# EasyEDA Pro project CH335fUSBHub_250914_A.epro

# Schematic CH335HUB_SCH
Board Name: CH335HUB; Create Date: 2025-09-14; Page Name: P1; Project Name: CH335F USB HUB; Schematic Name: CH335HUB_SCH; Update Date: 2025-09-14; Company: 嘉立创EDA; Page Size: A4; Version: V1.0
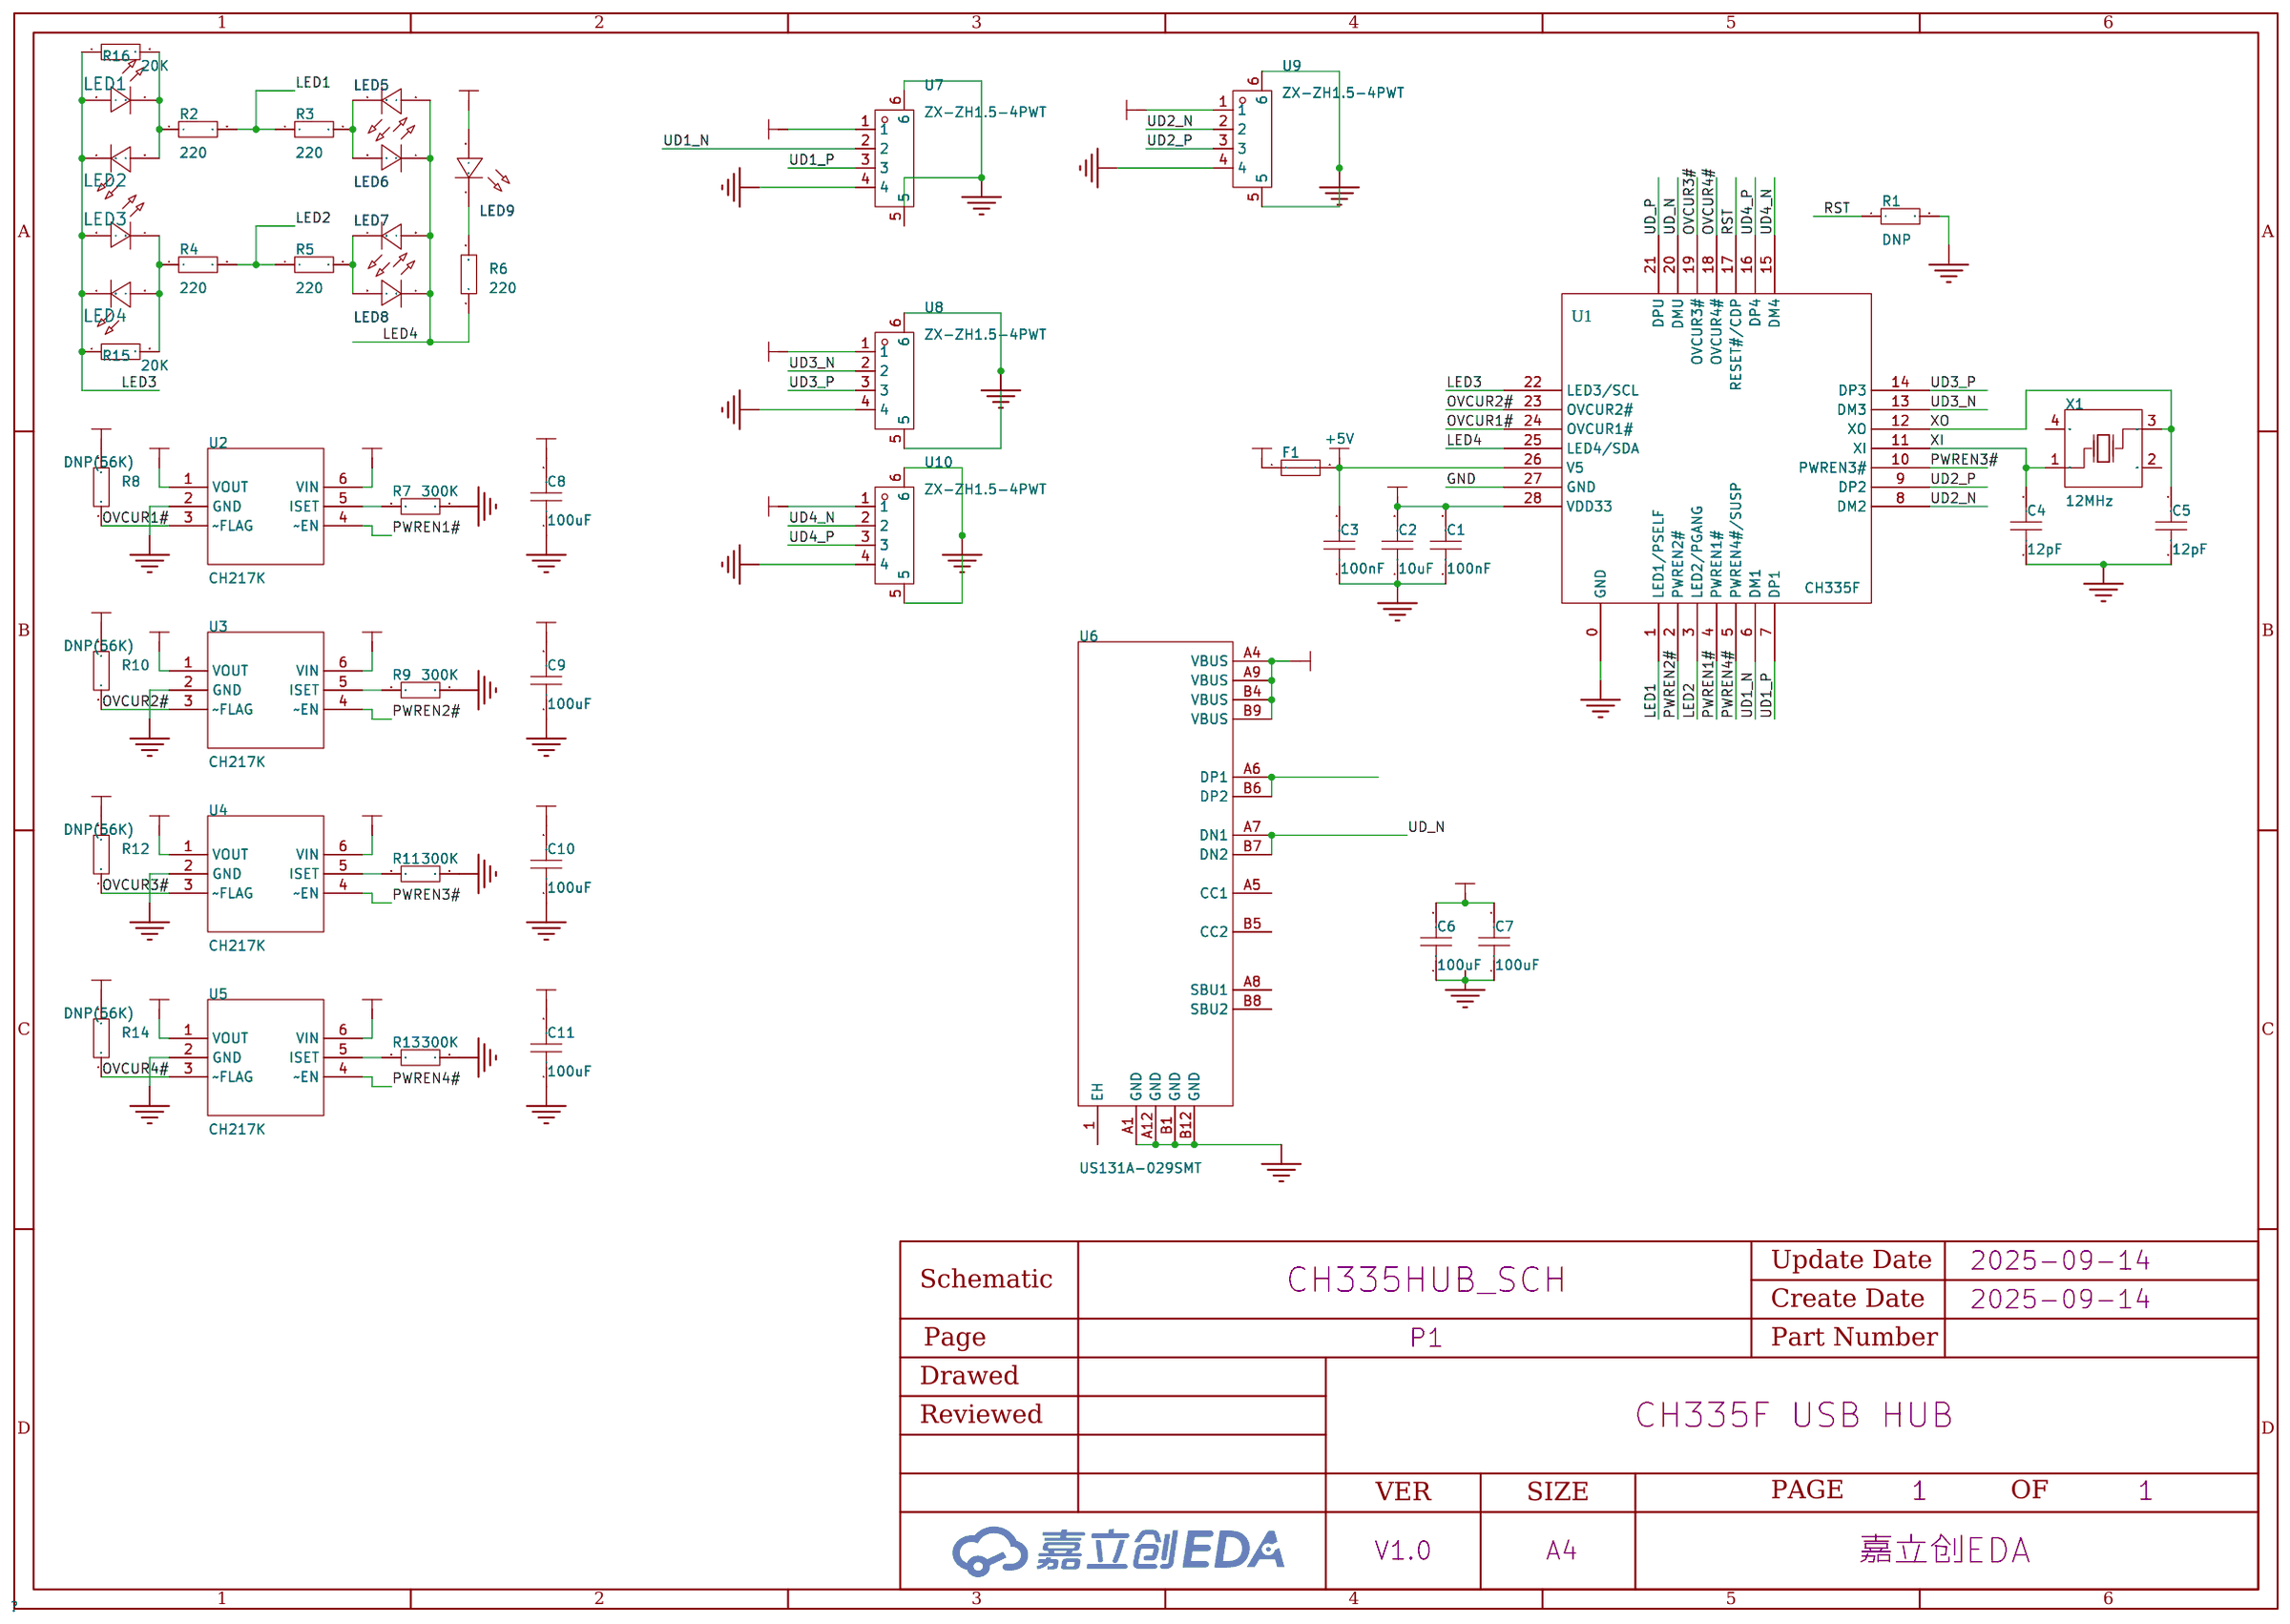
[diagram p0: schematic sheet]

## Parts
C1  100nF  [C0805]
C2  10uF  [C0805]
C3  100nF  [C0805]
C4  12pF  [C0805]
C5  12pF  [C0805]
C6  100uF  [C1206]
C7  100uF  [C1206]
C8  100uF  [C1206]
C9  100uF  [C1206]
C10  100uF  [C1206]
C11  100uF  [C1206]
F1  SMD0805B050TF  [F0805]
LED1  -  [LED_0805]
LED2  -  [LED_0805]
LED3  -  [LED_0805]
LED4  -  [LED_0805]
LED5  -  [LED_0805]
LED6  -  [LED_0805]
LED7  -  [LED_0805]
LED8  -  [LED_0805]
LED9  -  [LED_0805]
R1  DNP  [R0805]
R2  220  [R0805]
R3  220  [R0805]
R4  220  [R0805]
R5  220  [R0805]
R6  220  [R0805]
R7  300K  [R0805]
R8  DNP(56K)  [R0805]
R9  300K  [R0805]
R10  DNP(56K)  [R0805]
R11  300K  [R0805]
R12  DNP(56K)  [R0805]
R13  300K  [R0805]
R14  DNP(56K)  [R0805]
R15  20K  [R0805]
R16  20K  [R0805]
U1  CH335F  [QFN-28_L4.0-W4.0-P0.40-TL]
U2  CH217K  [SOT-23-6_L2.9-W1.6-P0.95-LS2.8-TL]
U3  CH217K  [SOT-23-6_L2.9-W1.6-P0.95-LS2.8-TL]
U4  CH217K  [SOT-23-6_L2.9-W1.6-P0.95-LS2.8-TL]
U5  CH217K  [SOT-23-6_L2.9-W1.6-P0.95-LS2.8-TL]
U6  US131A-029SMT  [USB-TYPE-C-SMD_US131A-029SMT]
U7  ZX-ZH1.5-4PWT  [CONN-SMD_4P-P1.50_ZX-ZH1.5-4PWT]
U8  ZX-ZH1.5-4PWT  [CONN-SMD_4P-P1.50_ZX-ZH1.5-4PWT]
U9  ZX-ZH1.5-4PWT  [CONN-SMD_4P-P1.50_ZX-ZH1.5-4PWT]
U10  ZX-ZH1.5-4PWT  [CONN-SMD_4P-P1.50_ZX-ZH1.5-4PWT]
X1  12MHz  [OSC-SMD_4P-L3.2-W2.5-BL]

## Library data of the parts
C1-C5 = CAP_0805: Supplier Footprint: 0805
C6-C11 = CAP_1206: Supplier Footprint: 1206
F1 = SMD0805B050TF: 最大电压:6V;最大电流:100A;保持电流:500mA;跳闸电流:1A;; LCSC Part Name: 6V 500mA 0805自恢复; Supplier Part: C269104; Manufacturer: Brightking(君耀电子); Supplier Footprint: 0805; JLCPCB Part Class: Extended Part; Datasheet: https://atta.szlcsc.com/upload/public/pdf/source/20180814/C269104_466839A5DB65F6E723CA6A162ACE747B.pdf; Supplier: LCSC; Operating Voltage (Max): 6V; Current Rating (Max): 100A; Hold Current: 500mA; Trip Current: 1A; Maximum Time to Trip: 100ms
LED1-LED4 = LED_0805-R: Supplier Footprint: 0805
LED5-LED9 = LED_0805-G: Supplier Footprint: 0805
R1-R16 = Res_0805: Supplier Footprint: 0805
U1 = CH335F-LBX: 4 ports High-Speed USB MTT Hub with 4 over current detect  power control
U2-U5 = CH217K
U6 = US131A-029SMT: Supplier Part: C9900106106; Supplier Footprint: TYPE-C-16P; JLCPCB Part Class: 扩展库; Supplier: LCSC
U7-U10 = ZX-ZH1.5-4PWT: 插针结构:1x4P;间距:1.5mm;安装方式:卧贴;参考系列:ZH;总PIN数:4P;排数:1;每排PIN数:4;行距:-;额定电流:-;触头材质:黄铜;触头镀层:-;工作温度:-25℃~+85℃;; LCSC Part Name: 1x4P 间距:1.5mm 卧贴 系列:ZH; Supplier Part: C19272407; Manufacturer: Megastar(兆星); Supplier Footprint: SMD,P=1.5mm,卧贴; JLCPCB Part Class: 扩展库; Datasheet: https://item.szlcsc.com/datasheet/ZX-ZH1.5-4PWT/20550418.html; Supplier: LCSC; Pins Structure: 1x4P; Pitch: 1.5mm; Mounting Type: 卧贴; Reference Series: ZH; Number of Pins: 4P; Number of Rows: 1; Number of PINs Per Row: 4; Contact Material: 黄铜; Operating Temperature: -25℃~+85℃; Voltage Rating: 250V; Plastic Material: LCP; Supplementary Features: 辅助焊脚; Color: 米色; Z-Height of the Board: 3.8mm; X-Length of Bottom Edge on Board (Spacing Line): 9mm; Y-Width of Bottom Edge on Board: 6.5mm
X1 = X322512MSB4SI: 频率:12MHz;频率公差:±10ppm;负载电容:20pF;; LCSC Part Name: 12MHz ±10ppm 20pF YSX321SL; Supplier Part: C9002; Manufacturer: YXC(扬兴晶振); Supplier Footprint: SMD3225-4P; JLCPCB Part Class: Basic Part; Datasheet: https://atta.szlcsc.com/upload/public/pdf/source/20210329/C112971_1F611BDC486E193C1706F6D8EB5AA189.pdf; Supplier: LCSC; Crystal Type: 贴片无源晶振; Frequency Tolerance: ±10ppm; Frequency Stability: ±30ppm; Load Capacitance: 20pF; Operating Temperature: -40℃~+85℃

## Nets
+3.3V: C1.2 C2.2 LED9.2(A) R8.2 R10.2 R12.2 R14.2 U1.28(VDD33)
+5V: C3.2 F1.2 U1.26(V5)
GND: C1.1 C2.1 C3.1 C4.1 C5.1 C6.1 C7.1 C8.1 C9.1 C10.1 C11.1 R1.2 R7.1 R9.1 R11.1 R13.1 U1.0(GND) U1.27(GND) U2.2(GND) U3.2(GND) U4.2(GND) U5.2(GND) U6.A1(GND) U6.A12(GND) U6.B1(GND) U6.B12(GND) U7.4 U7.5 U7.6 U8.4 U8.5 U8.6 U9.4 U9.5 U9.6 U10.4 U10.5 U10.6
VIN: C6.2 C7.2 F1.1 U2.6(VIN) U3.6(VIN) U4.6(VIN) U5.6(VIN) U6.A4(VBUS) U6.A9(VBUS) U6.B4(VBUS) U6.B9(VBUS)
LED1: R2.2 R3.1 U1.1(LED1/PSELF)
LED2: R4.2 R5.1 U1.3(LED2/PGANG)
LED3: LED1.2(A) LED2.1(C) LED3.2(A) LED4.1(C) R15.1 R16.1 U1.22(LED3/SCL)
LED4: LED5.2(A) LED6.1(C) LED7.2(A) LED8.1(C) R6.1 U1.25(LED4/SDA)
OVCUR1#: R8.1 U1.24(OVCUR1#) U2.3(~FLAG)
OVCUR2#: R10.1 U1.23(OVCUR2#) U3.3(~FLAG)
OVCUR3#: R12.1 U1.19(OVCUR3#) U4.3(~FLAG)
OVCUR4#: R14.1 U1.18(OVCUR4#) U5.3(~FLAG)
PWREN1#: U1.4(PWREN1#) U2.4(~EN)
PWREN2#: U1.2(PWREN2#) U3.4(~EN)
PWREN3#: U1.10(PWREN3#) U4.4(~EN)
PWREN4#: U1.5(PWREN4#/SUSP) U5.4(~EN)
RST: R1.1 U1.17(RESET#/CDP)
UD1_N: U1.6(DM1) U7.2
UD1_P: U1.7(DP1) U7.3
UD2_N: U1.8(DM2) U9.2
UD2_P: U1.9(DP2) U9.3
UD3_N: U1.13(DM3) U8.2
UD3_P: U1.14(DP3) U8.3
UD4_N: U1.15(DM4) U10.2
UD4_P: U1.16(DP4) U10.3
UD_N: U1.20(DMU) U6.A7(DN1) U6.B7(DN2)
UD_P: U1.21(DPU)
VUSB1: C8.2 U2.1(VOUT) U7.1
VUSB2: C9.2 U3.1(VOUT) U9.1
VUSB3: C10.2 U4.1(VOUT) U8.1
VUSB4: C11.2 U5.1(VOUT) U10.1
XI: C4.2 U1.11(XI) X1.1(OSC1)
XO: C5.2 U1.12(XO) X1.3(OSC2)
$1N2109: U6.A6(DP1) U6.B6(DP2)
$1N2596: LED5.1(C) LED6.2(A) R3.2
$1N2605: LED7.1(C) LED8.2(A) R5.2
$1N2631: LED9.1(C) R6.2
$1N2772: R7.2 U2.5(ISET)
$1N4110: R9.2 U3.5(ISET)
$1N4299: R11.2 U4.5(ISET)
$1N4492: R13.2 U5.5(ISET)
$1N6424: LED3.1(C) LED4.2(A) R4.1 R15.2
$1N7334: LED1.1(C) LED2.2(A) R2.1 R16.2

Not connected (* = marked no-connect by the designer): U6 1(EH) A5(CC1) A8(SBU1) B5(CC2) B8(SBU2); X1 2(GND) 4(GND)

# Board PCB2
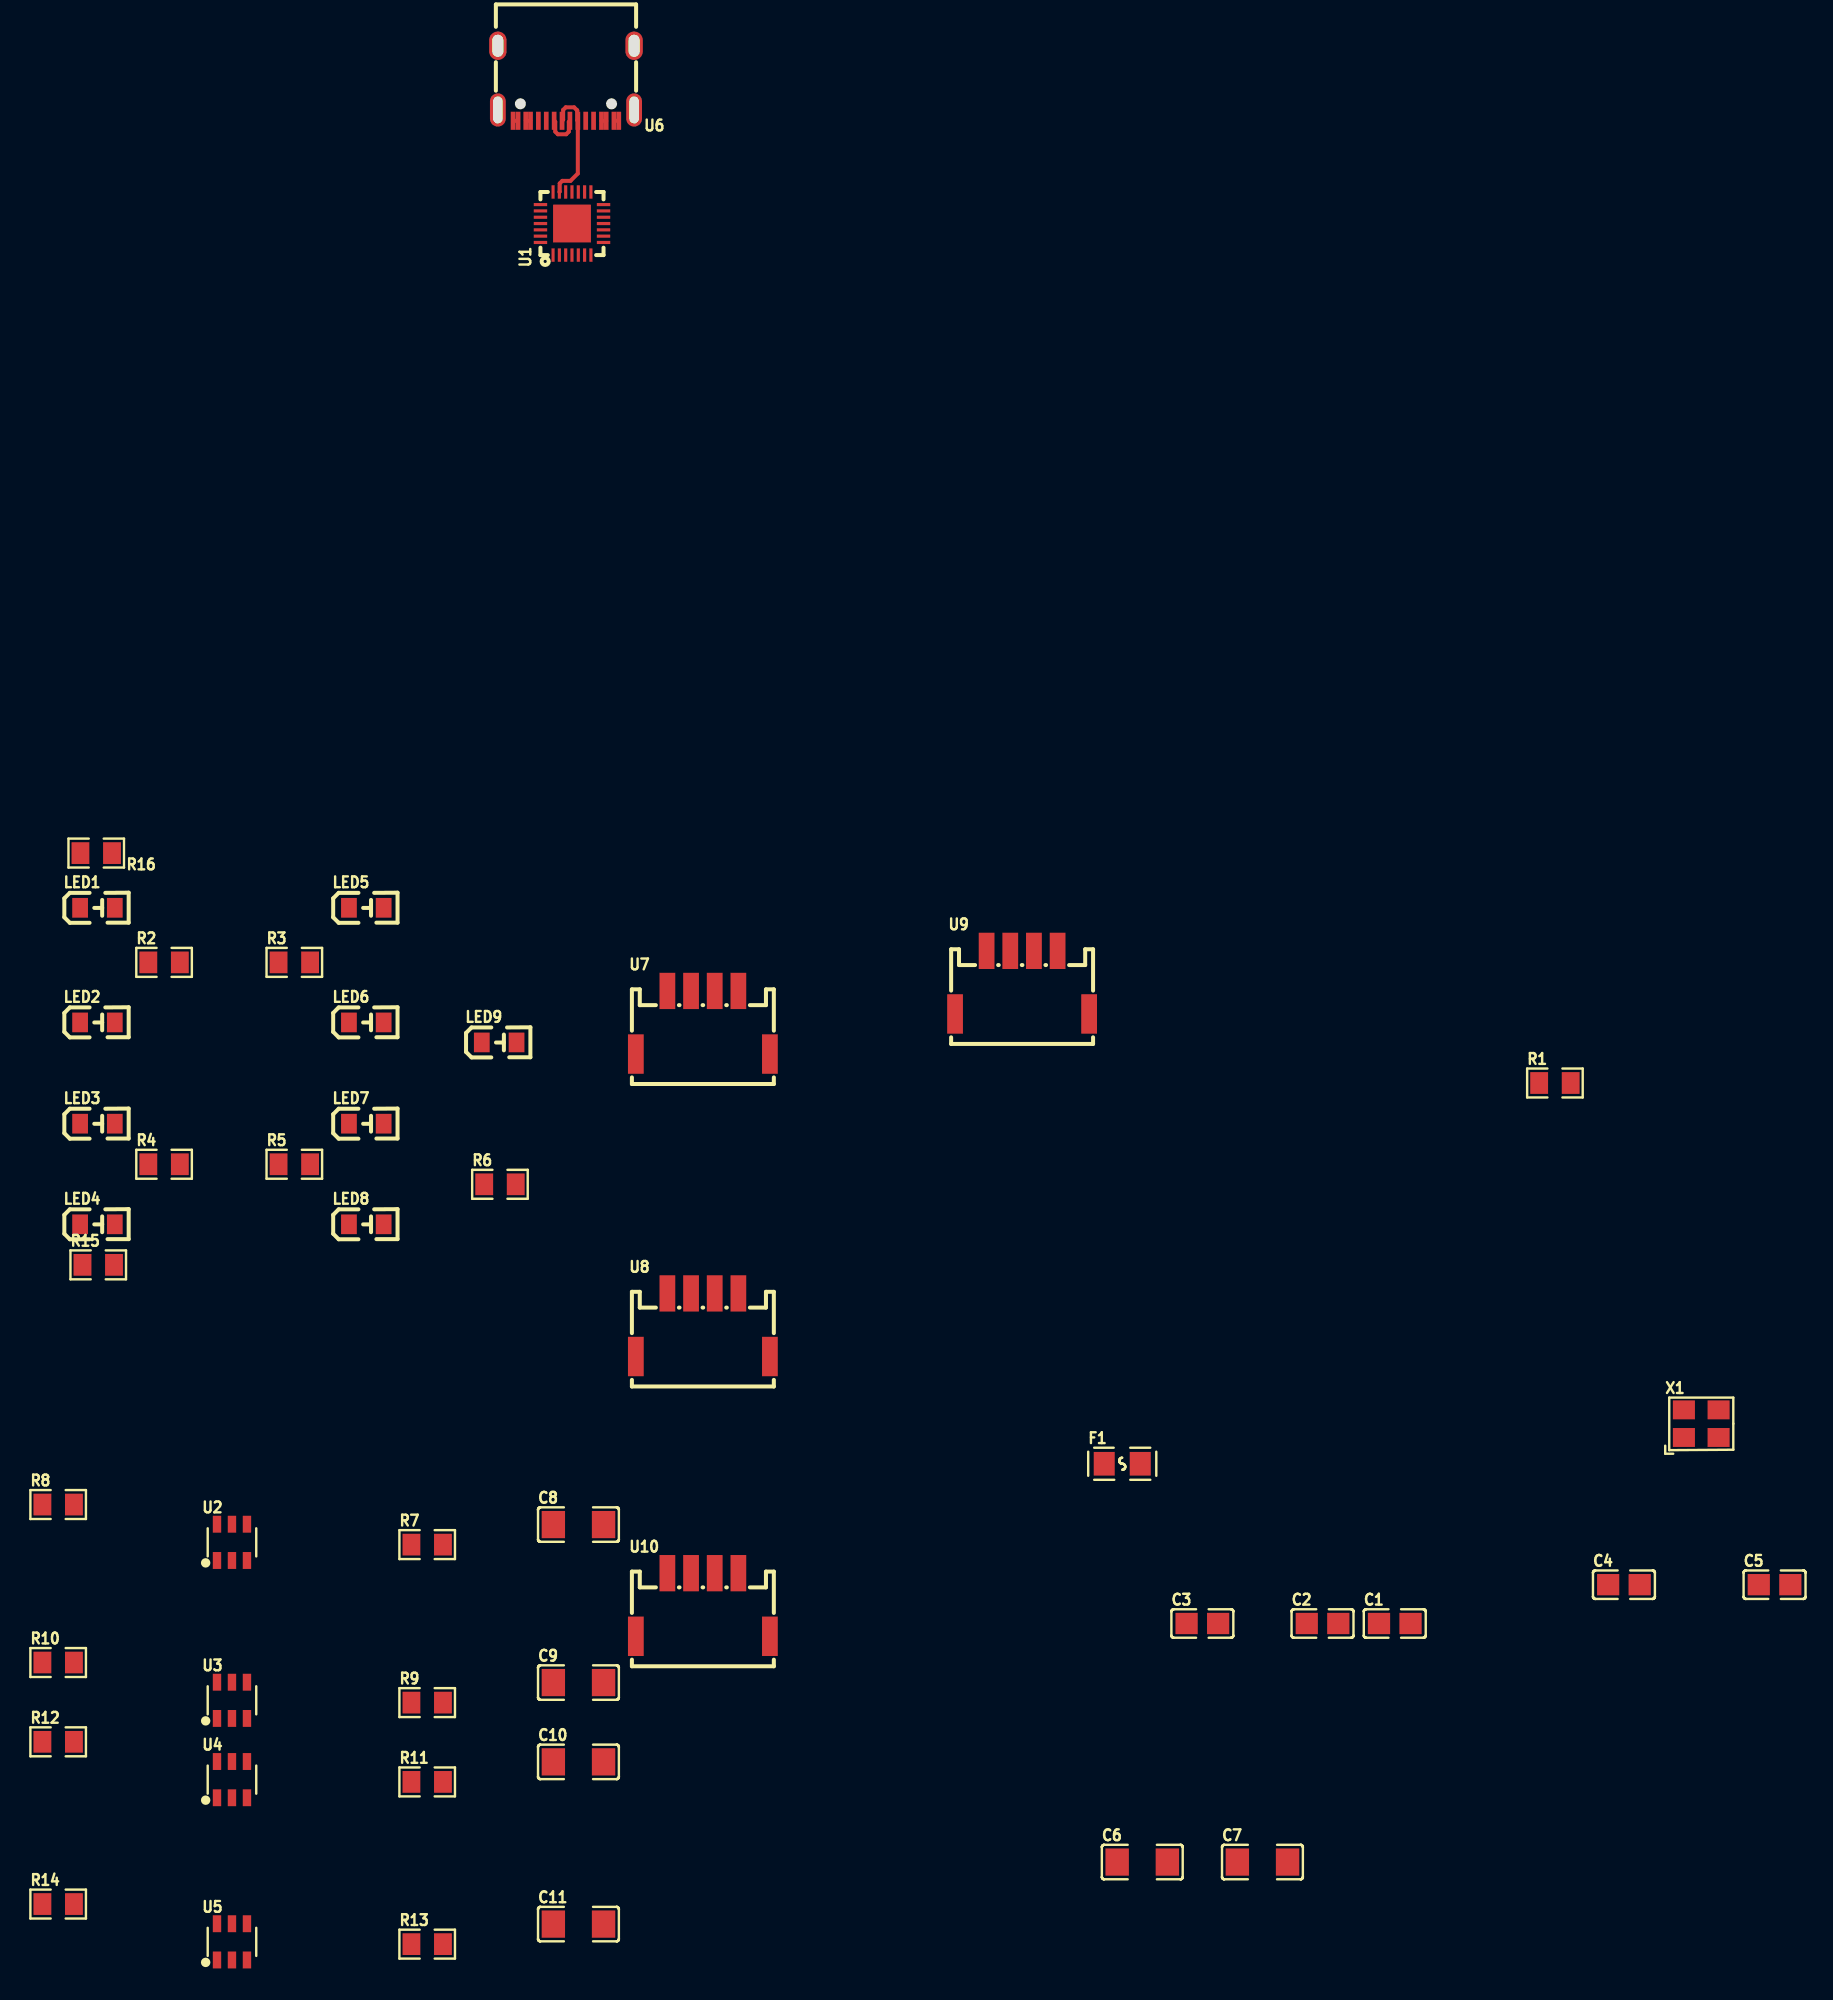
[diagram p1: board, top side]
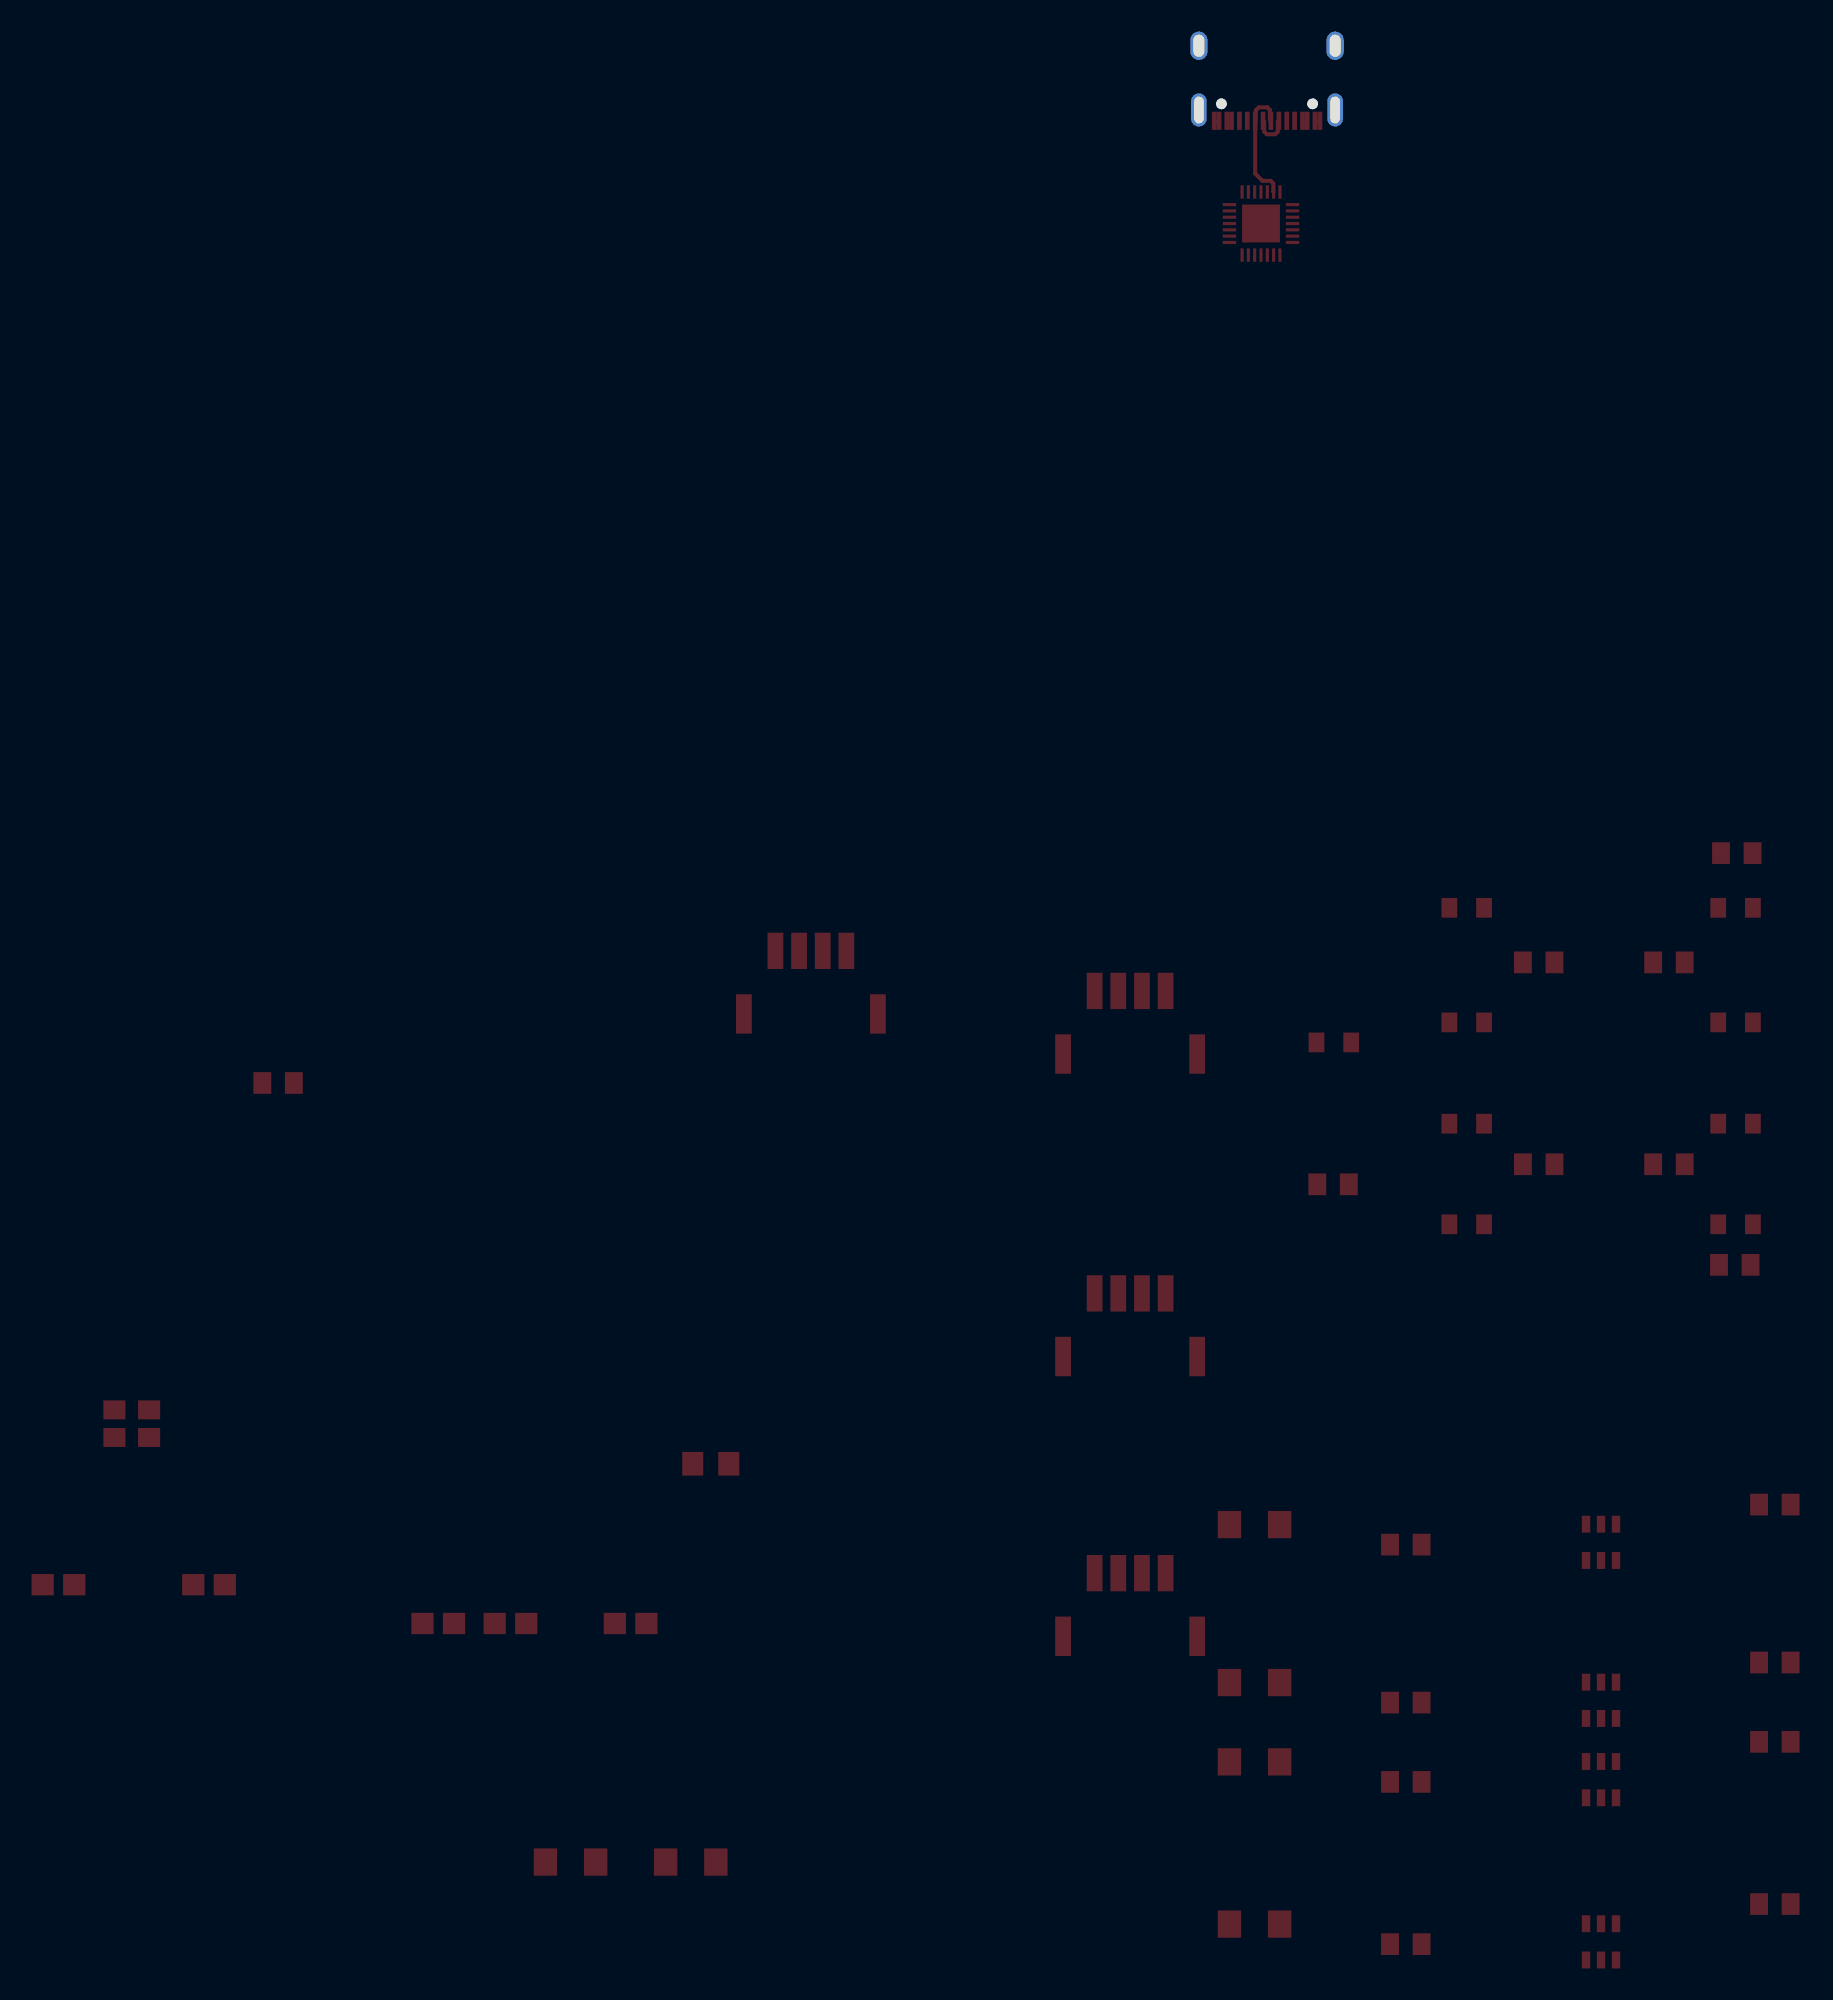
[diagram p2: board, bottom side, seen from below]

Outline 6.47 x 0.69 mm; copper layers: Top Layer, Bottom Layer. Coordinates in mm from the lower left corner of the outline.
Stack: Top Layer 0.035mm / Dielectric1 1.51mm FR4 er 4.5 / Bottom Layer 0.035mm

## Design rules (mm)
template: JLCPCB Capability(Two Layers Board)
spacing copperThickness1oz (default): track to track 0.102, other pairs 0.152 to 0.3
spacing copperThickness2oz: track to track 0.203, other pairs 0.152 to 0.3
track width copperThickness1oz (default): min 0.127, default 0.254, max 2.54
track width copperThickness2oz: min 0.203, default 0.254, max 2.54
differential pair differentialPair (default): width min 0.127, default 0.254, max 2.54; gap min 0.152, default 0.152
via viaSize (default): diameter min 0.5, default 0.61, max 10; hole min 0.3, default 0.305, max 6.3

## Placement (name value [footprint] x y rotation side)
C1  100nF  [C0805]  55.79 -95.97 0 top
C2  10uF  [C0805]  51.21 -95.97 0 top
C3  100nF  [C0805]  43.59 -95.97 0 top
C4  12pF  [C0805]  70.32 -93.51 0 top
C5  12pF  [C0805]  79.87 -93.51 0 top
C6  100uF  [C1206]  39.78 -111.09 0 top
C7  100uF  [C1206]  47.4 -111.09 0 top
C8  100uF  [C1206]  4.03 -89.7 0 top
C9  100uF  [C1206]  4.03 -99.71 0 top
C10  100uF  [C1206]  4.03 -104.74 0 top
C11  100uF  [C1206]  4.03 -115.02 0 top
F1  SMD0805B050TF  [F0805]  38.51 -85.85 0 top
LED1  -  [LED_0805]  -26.42 -50.62 0 top
LED2  -  [LED_0805]  -26.42 -57.88 0 top
LED3  -  [LED_0805]  -26.42 -64.3 0 top
LED4  -  [LED_0805]  -26.42 -70.67 0 top
LED5  -  [LED_0805]  -9.37 -50.62 0 top
LED6  -  [LED_0805]  -9.37 -57.88 0 top
LED7  -  [LED_0805]  -9.37 -64.3 0 top
LED8  -  [LED_0805]  -9.37 -70.67 0 top
LED9  -  [LED_0805]  -0.95 -59.15 0 top
R1  DNP  [R0805]  65.94 -61.71 0 top
R2  220  [R0805]  -22.25 -54.07 0 top
R3  220  [R0805]  -13.99 -54.07 0 top
R4  220  [R0805]  -22.25 -66.86 0 top
R5  220  [R0805]  -13.99 -66.86 0 top
R6  220  [R0805]  -0.95 -68.13 0 top
R7  300K  [R0805]  -5.56 -90.97 0 top
R8  DNP(56K)  [R0805]  -28.96 -88.43 0 top
R9  300K  [R0805]  -5.56 -100.98 0 top
R10  DNP(56K)  [R0805]  -28.96 -98.44 0 top
R11  300K  [R0805]  -5.56 -106.01 0 top
R12  DNP(56K)  [R0805]  -28.96 -103.47 0 top
R13  300K  [R0805]  -5.56 -116.29 0 top
R14  DNP(56K)  [R0805]  -28.96 -113.75 0 top
R15  20K  [R0805]  -26.42 -73.24 0 top
R16  20K  [R0805]  -26.55 -47.14 180 top
U1  CH335F  [QFN-28_L4.0-W4.0-P0.40-TL]  3.62 -7.24 90 top
U2  CH217K  [SOT-23-6_L2.9-W1.6-P0.95-LS2.8-TL]  -17.94 -90.97 0 top
U3  CH217K  [SOT-23-6_L2.9-W1.6-P0.95-LS2.8-TL]  -17.94 -100.98 0 top
U4  CH217K  [SOT-23-6_L2.9-W1.6-P0.95-LS2.8-TL]  -17.94 -106.01 0 top
U5  CH217K  [SOT-23-6_L2.9-W1.6-P0.95-LS2.8-TL]  -17.94 -116.29 0 top
U6  US131A-029SMT  [USB-TYPE-C-SMD_US131A-029SMT]  3.24 1.65 180 top
U7  ZX-ZH1.5-4PWT  [CONN-SMD_4P-P1.50_ZX-ZH1.5-4PWT]  11.92 -57.88 0 top
U8  ZX-ZH1.5-4PWT  [CONN-SMD_4P-P1.50_ZX-ZH1.5-4PWT]  11.92 -77.05 0 top
U9  ZX-ZH1.5-4PWT  [CONN-SMD_4P-P1.50_ZX-ZH1.5-4PWT]  32.16 -55.34 0 top
U10  ZX-ZH1.5-4PWT  [CONN-SMD_4P-P1.50_ZX-ZH1.5-4PWT]  11.92 -94.78 0 top
X1  12MHz  [OSC-SMD_4P-L3.2-W2.5-BL]  75.22 -83.31 0 top

## Footprints (pads in the part's own frame, mm; a bottom-side part is the same pattern mirrored in y, then rotated)
C0805
  rect 1.41x1.35 smd: 1(-1,0) 2(1,0)
C1206
  rect 1.485x1.728 smd: 1(-1.593,0) 2(1.593,0)
CONN-SMD_4P-P1.50_ZX-ZH1.5-4PWT
  rect 1x2.3 smd: 1(-2.25,2) 2(-0.75,2) 3(0.75,2) 4(2.25,2)
  rect 1x2.5 smd: 5(4.25,-2) 6(-4.25,-2)
F0805
  rect 1.335x1.5 smd: 1(-1.143,0) 2(1.143,0)
LED_0805
  rect 1x1.25 smd: 1(-1.15,0.005) 2(1.05,0.005)
OSC-SMD_4P-L3.2-W2.5-BL
  rect 1.4x1.2 smd: 1(-1.1,-0.875) 2(1.1,-0.875) 3(1.1,0.875) 4(-1.1,0.875)
QFN-28_L4.0-W4.0-P0.40-TL
  rect 2.4x2.4 smd: 0(0,-0.001)
  rect 0.85x0.2 smd: 1(-2,1.2) 2(-2,0.8) 3(-2,0.4) 4(-2,0.001) 5(-2,-0.4) 6(-2,-0.8) 7(-2,-1.2) 15(2,-1.2) 16(2,-0.8) 17(2,-0.4) 18(2,0) 19(2,0.4) 20(2,0.8) 21(2,1.2)
  rect 0.2x0.85 smd: 8(-1.2,-2) 9(-0.8,-2) 10(-0.4,-2) 11(0,-2) 12(0.4,-2) 13(0.8,-2) 14(1.2,-2) 22(1.2,2) 23(0.8,2) 24(0.4,2) 25(0,2) 26(-0.4,2) 27(-0.8,2) 28(-1.2,2)
R0805
  rect 1.133x1.377 smd: 1(-1,0) 2(1,0)
SOT-23-6_L2.9-W1.6-P0.95-LS2.8-TL
  rect 0.532x1.072 smd: 1(-0.95,-1.005) 2(0,-1.005) 3(0.95,-1.005) 4(0.95,1.293) 5(0,1.293) 6(-0.95,1.293)
USB-TYPE-C-SMD_US131A-029SMT
  oval 1x2.1 hole 0.6x1.7: 1(-4.32,1.692) 1(4.32,1.692)
  oval 1.1x1.8 hole 0.7x1.4: 1(-4.32,-2.377) 1(4.32,-2.377)
  rect 0.3x1.15 smd: A1(-3.345,2.377) A4(-2.55,2.377) A5(-1.25,2.377) A6(-0.25,2.377) A7(0.25,2.377) A8(1.25,2.377) A9(2.55,2.377) A12(3.355,2.377) B1(3.04,2.377) B4(2.25,2.377) B5(1.75,2.377) B6(0.75,2.377) B7(-0.75,2.377) B8(-1.75,2.377) B9(-2.25,2.377) B12(-3.04,2.377)

## Nets
As in the schematic.

Pads without a net: U6 1 A5 A8 B5 B8; X1 2 4

## Routing (per net, layer and track width the routed paths; a pad name or vN(x,y) marks a point on that pad's centre or on a via; arc(x,y) is an arc through that point)
GND: length 0.6
  Top Layer w0.254: U6.B1 U6.A12 ; U6.A1 U6.B12
VIN: length 0.6
  Top Layer w0.254: U6.A4 U6.B9 ; U6.B4 U6.A9
UD_N: length 7.7
  Top Layer w0.254: U6.A7 3.06,-0.66 3.06,-0.04 3.22,0.13 3.75,0.13 3.92,-0.04 3.92,-0.04 3.95,-0.08 3.95,-0.69 U6.B7 3.99,-4.07 3.52,-4.54 3,-4.54 2.84,-4.7 2.84,-5.22 U1.20
$1N2109: length 2.4
  Top Layer w0.254: U6.B6 2.56,-0.8 2.56,-1.42 2.72,-1.58 3.25,-1.58 3.42,-1.42 3.42,-0.8 U6.A6

# Board CH335HUB_PCB
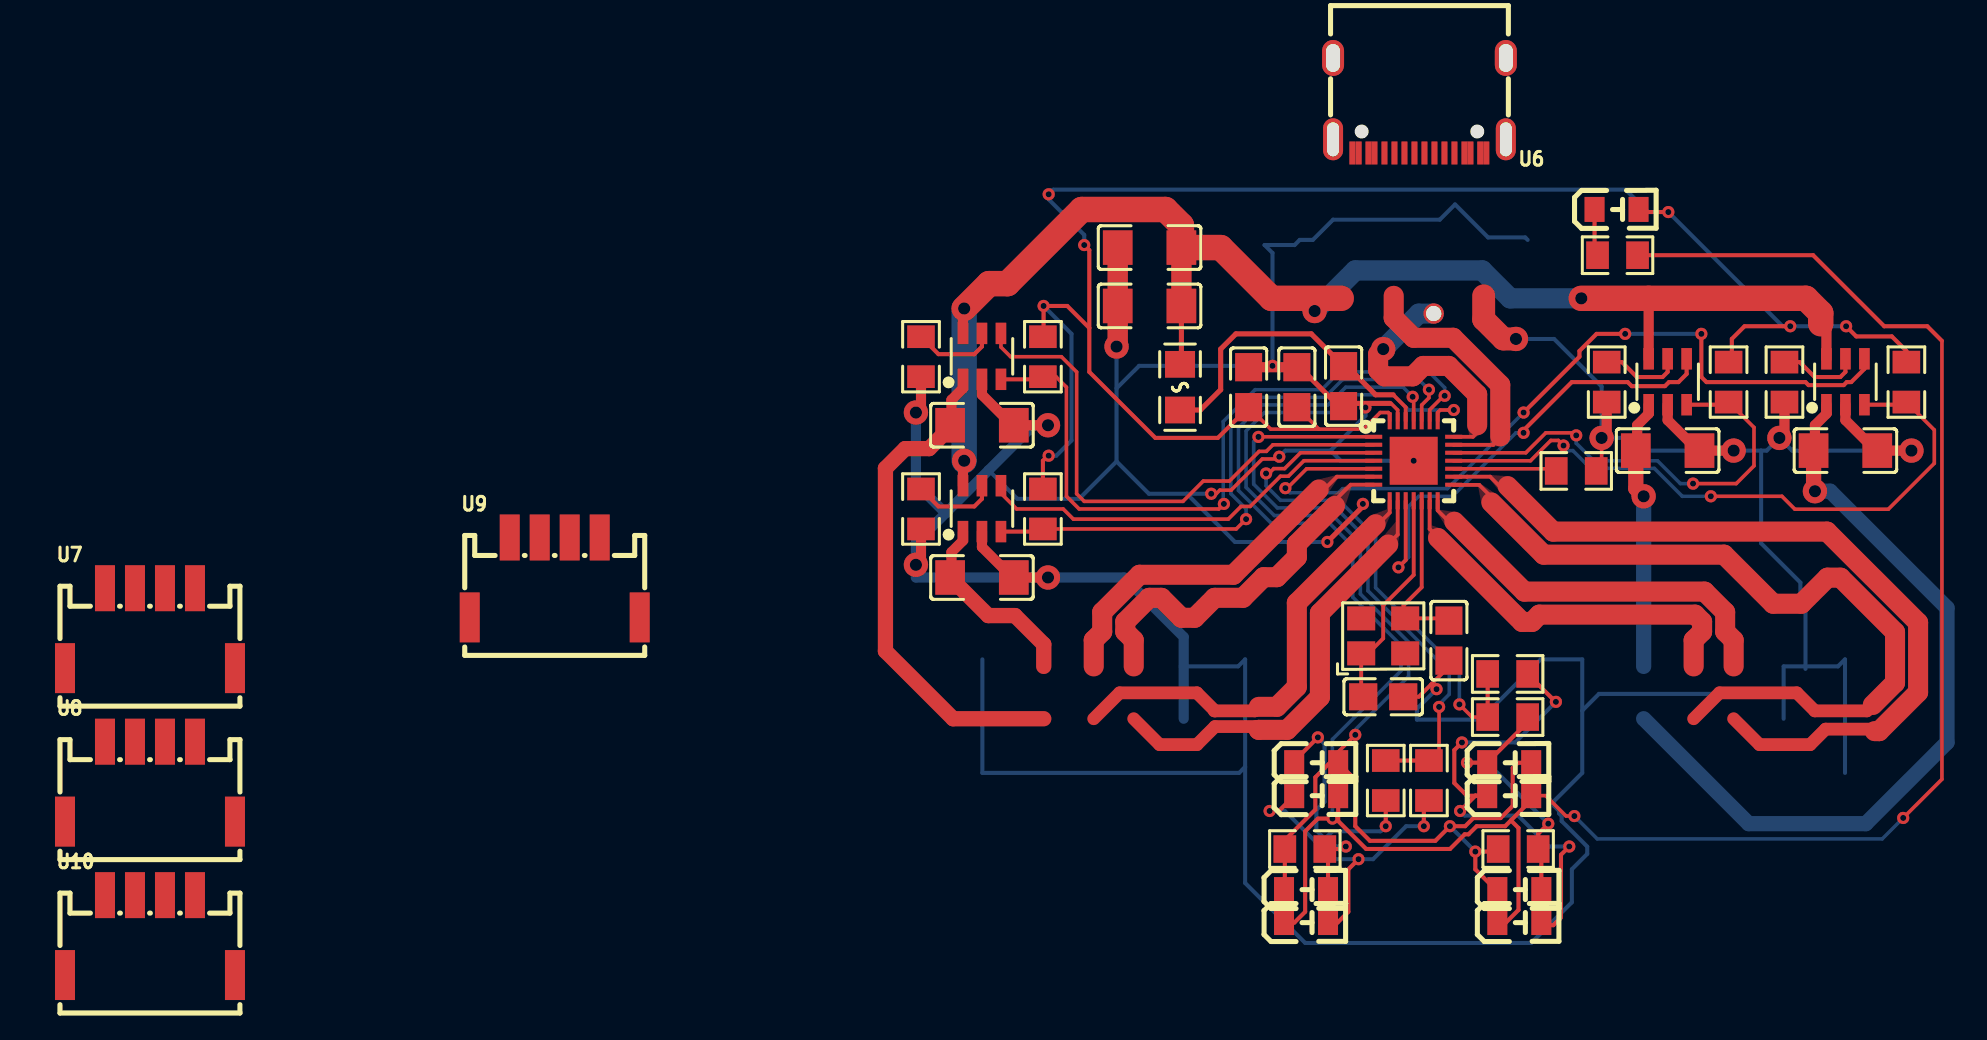
[diagram p3: board, top side]
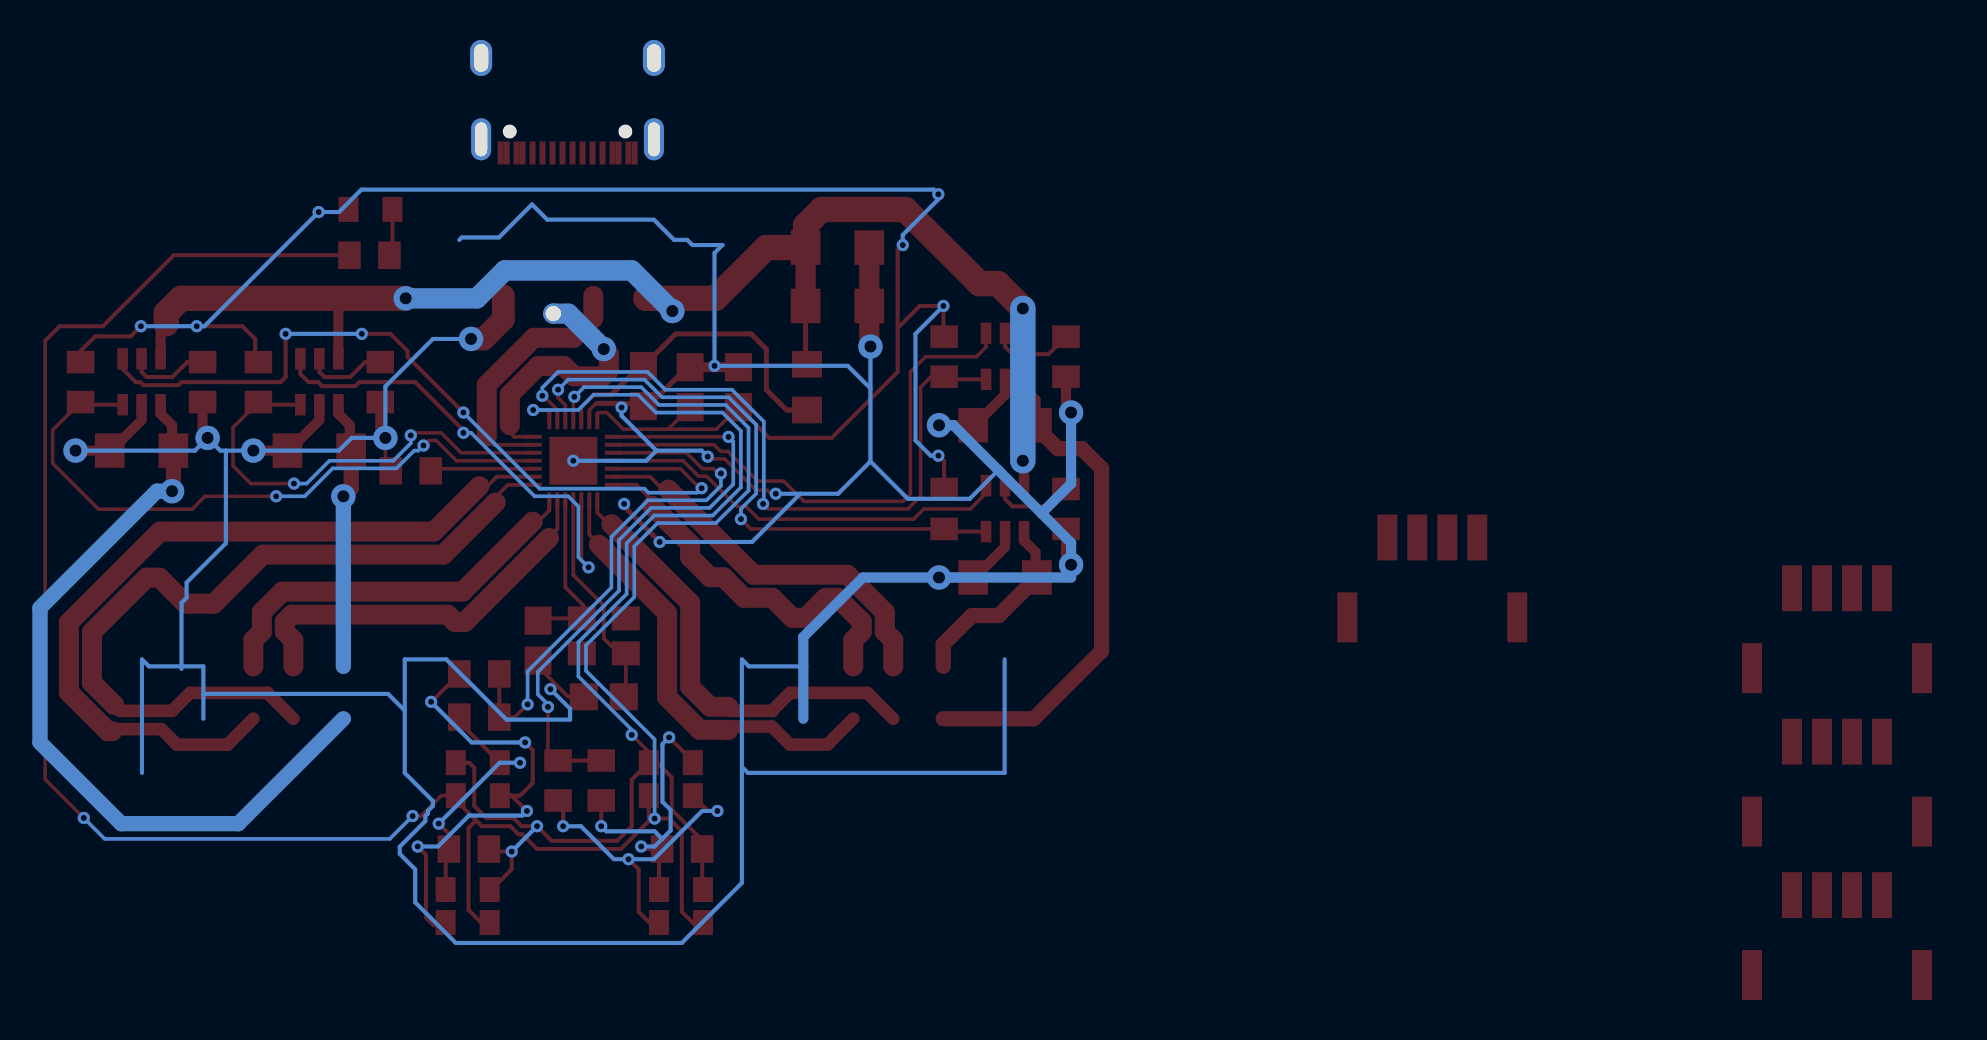
[diagram p4: board, bottom side, seen from below]

Outline 6.47 x 0.69 mm; copper layers: Top Layer, Bottom Layer. Coordinates in mm from the lower left corner of the outline.
Stack: Top Layer 0.035mm / Dielectric1 1.51mm FR4 er 4.5 / Bottom Layer 0.035mm

## Design rules (mm)
net UD_N: DP
net UD_P: DP
net UD1_N: DP1
net UD1_P: DP1
net UD2_N: DP2
net UD2_P: DP2
net UD3_N: DP3
net UD3_P: DP3
net UD4_N: DP4
net UD4_P: DP4
template: 自定义配置
spacing copperThickness1oz (default): track to track 0.203, other pairs 0.203 to 0.3
spacing copperThickness2oz: track to track 0.203, other pairs 0.152 to 0.3
track width copperThickness1oz (default): min 0.127, default 0.254, max 2.54
track width copperThickness2oz: min 0.203, default 0.254, max 2.54
differential pair differentialPair (default): width min 0.127, default 0.254, max 2.54; gap min 0.152, default 0.152
via viaSize (default): diameter min 0.5, default 0.61, max 10; hole min 0.3, default 0.305, max 6.299

## Placement (name value [footprint] x y rotation side)
C1  100nF  [C0805]  -5.31 -12.45 270 top
C2  10uF  [C0805]  -2.89 -12.45 270 top
C3  100nF  [C0805]  -0.56 -12.4 90 top
C4  12pF  [C0805]  1.42 -27.94 180 top
C5  12pF  [C0805]  4.71 -25.13 90 top
C6  100uF  [C1206]  -10.26 -5.46 0 top
C7  100uF  [C1206]  -10.26 -8.38 0 top
C8  100uF  [C1206]  -18.64 -21.97 180 top
C9  100uF  [C1206]  -18.64 -14.35 180 top
C10  100uF  [C1206]  15.65 -15.62 180 top
C11  100uF  [C1206]  24.54 -15.62 180 top
F1  SMD0805B050TF  [F0805]  -8.74 -12.45 270 top
LED1  -  [LED_0805]  -1.88 -31.24 0 top
LED2  -  [LED_0805]  -2.39 -37.59 0 top
LED3  -  [LED_0805]  7.77 -31.24 0 top
LED4  -  [LED_0805]  8.28 -37.59 0 top
LED5  -  [LED_0805]  -1.88 -32.89 0 top
LED6  -  [LED_0805]  -2.39 -39.24 0 top
LED7  -  [LED_0805]  7.77 -32.89 0 top
LED8  -  [LED_0805]  8.28 -39.24 0 top
LED9  -  [LED_0805]  13.14 -3.56 0 top
NOREF  -  [Pad_e214]  3.95 -8.76 0 top
R1  DNP  [R0805]  11.08 -16.64 0 top
R2  220  [R0805]  1.55 -32.13 90 top
R3  220  [R0805]  3.71 -32.13 270 top
R4  220  [R0805]  7.65 -28.96 180 top
R5  220  [R0805]  7.65 -26.8 0 top
R6  220  [R0805]  13.14 -5.84 180 top
R7  300K  [R0805]  -21.69 -18.54 90 top
R8  DNP(56K)  [R0805]  -15.59 -18.54 90 top
R9  300K  [R0805]  -21.69 -10.92 90 top
R10  DNP(56K)  [R0805]  -15.59 -10.92 90 top
R11  300K  [R0805]  12.6 -12.19 90 top
R12  DNP(56K)  [R0805]  18.7 -12.19 90 top
R13  300K  [R0805]  21.49 -12.19 90 top
R14  DNP(56K)  [R0805]  27.59 -12.19 90 top
R15  20K  [R0805]  8.17 -35.56 0 top
R16  20K  [R0805]  -2.5 -35.56 0 top
U1  CH335F  [QFN-28_L4.0-W4.0-P0.40-TL]  2.95 -16.13 0 top
U2  CH217K  [SOT-23-6_L2.9-W1.6-P0.95-LS2.8-TL]  -18.64 -18.67 0 top
U3  CH217K  [SOT-23-6_L2.9-W1.6-P0.95-LS2.8-TL]  -18.64 -11.05 0 top
U4  CH217K  [SOT-23-6_L2.9-W1.6-P0.95-LS2.8-TL]  15.65 -12.32 0 top
U5  CH217K  [SOT-23-6_L2.9-W1.6-P0.95-LS2.8-TL]  24.54 -12.32 0 top
U6  US131A-029SMT  [USB-TYPE-C-SMD_US131A-029SMT]  3.24 1.65 180 top
U7  ZX-ZH1.5-4PWT  [CONN-SMD_4P-P1.50_ZX-ZH1.5-4PWT]  -60.25 -24.51 0 top
U8  ZX-ZH1.5-4PWT  [CONN-SMD_4P-P1.50_ZX-ZH1.5-4PWT]  -60.25 -32.19 0 top
U9  ZX-ZH1.5-4PWT  [CONN-SMD_4P-P1.50_ZX-ZH1.5-4PWT]  -40.01 -21.97 0 top
U10  ZX-ZH1.5-4PWT  [CONN-SMD_4P-P1.50_ZX-ZH1.5-4PWT]  -60.25 -39.87 0 top
X1  12MHz  [OSC-SMD_4P-L3.2-W2.5-BL]  1.42 -24.89 0 top

## Footprints (pads in the part's own frame, mm; a bottom-side part is the same pattern mirrored in y, then rotated)
C0805
  rect 1.41x1.35 smd: 1(-1,0) 2(1,0)
C1206
  rect 1.485x1.728 smd: 1(-1.593,0) 2(1.593,0)
CONN-SMD_4P-P1.50_ZX-ZH1.5-4PWT
  rect 1x2.3 smd: 1(-2.25,2) 2(-0.75,2) 3(0.75,2) 4(2.25,2)
  rect 1x2.5 smd: 5(4.25,-2) 6(-4.25,-2)
F0805
  rect 1.335x1.5 smd: 1(-1.143,0) 2(1.143,0)
LED_0805
  rect 1x1.25 smd: 1(-1.15,0.005) 2(1.05,0.005)
OSC-SMD_4P-L3.2-W2.5-BL
  rect 1.4x1.2 smd: 1(-1.1,-0.875) 2(1.1,-0.875) 3(1.1,0.875) 4(-1.1,0.875)
Pad_e214
  round 1.016 hole 0.762: 1(0,0)
QFN-28_L4.0-W4.0-P0.40-TL
  rect 2.4x2.4 smd: 0(0,-0.001)
  rect 0.85x0.2 smd: 1(-2,1.2) 2(-2,0.8) 3(-2,0.4) 4(-2,0.001) 5(-2,-0.4) 6(-2,-0.8) 7(-2,-1.2) 15(2,-1.2) 16(2,-0.8) 17(2,-0.4) 18(2,0) 19(2,0.4) 20(2,0.8) 21(2,1.2)
  rect 0.2x0.85 smd: 8(-1.2,-2) 9(-0.8,-2) 10(-0.4,-2) 11(0,-2) 12(0.4,-2) 13(0.8,-2) 14(1.2,-2) 22(1.2,2) 23(0.8,2) 24(0.4,2) 25(0,2) 26(-0.4,2) 27(-0.8,2) 28(-1.2,2)
R0805
  rect 1.133x1.377 smd: 1(-1,0) 2(1,0)
SOT-23-6_L2.9-W1.6-P0.95-LS2.8-TL
  rect 0.532x1.072 smd: 1(-0.95,-1.005) 2(0,-1.005) 3(0.95,-1.005) 4(0.95,1.293) 5(0,1.293) 6(-0.95,1.293)
USB-TYPE-C-SMD_US131A-029SMT
  oval 1x2.1 hole 0.6x1.7: 1(-4.32,1.692) 1(4.32,1.692)
  oval 1.1x1.8 hole 0.7x1.4: 1(-4.32,-2.377) 1(4.32,-2.377)
  rect 0.3x1.15 smd: A1(-3.345,2.377) A4(-2.55,2.377) A5(-1.25,2.377) A6(-0.25,2.377) A7(0.25,2.377) A8(1.25,2.377) A9(2.55,2.377) A12(3.355,2.377) B1(3.04,2.377) B4(2.25,2.377) B5(1.75,2.377) B6(0.75,2.377) B7(-0.75,2.377) B8(-1.75,2.377) B9(-2.25,2.377) B12(-3.04,2.377)

## Nets
+3.3V: C1.2 C2.2 LED9.2 R8.2 R10.2 R12.2 R14.2 U1.28
+5V: C3.2 F1.2 U1.26
GND: C1.1 C2.1 C3.1 C4.1 C5.1 C6.1 C7.1 C8.1 C9.1 C10.1 C11.1 R1.2 R7.1 R9.1 R11.1 R13.1 U1.0 U1.27 U2.2 U3.2 U4.2 U5.2 U6.A1 U6.A12 U6.B1 U6.B12 U7.4 U7.5 U7.6 U8.4 U8.5 U8.6 U9.4 U9.5 U9.6 U10.4 U10.5 U10.6
VIN: C6.2 C7.2 F1.1 U2.6 U3.6 U4.6 U5.6 U6.A4 U6.A9 U6.B4 U6.B9
LED1: R2.2 R3.1 U1.1
LED2: R4.2 R5.1 U1.3
LED3: LED1.2 LED2.1 LED3.2 LED4.1 R15.1 R16.1 U1.22
LED4: LED5.2 LED6.1 LED7.2 LED8.1 R6.1 U1.25
OVCUR1#: R8.1 U1.24 U2.3
OVCUR2#: R10.1 U1.23 U3.3
OVCUR3#: R12.1 U1.19 U4.3
OVCUR4#: R14.1 U1.18 U5.3
PWREN1#: U1.4 U2.4
PWREN2#: U1.2 U3.4
PWREN3#: U1.10 U4.4
PWREN4#: U1.5 U5.4
RST: R1.1 U1.17
UD1_N: U1.6 U7.2
UD1_P: U1.7 U7.3
UD2_N: U1.8 U9.2
UD2_P: U1.9 U9.3
UD3_N: U1.13 U8.2
UD3_P: U1.14 U8.3
UD4_N: U1.15 U10.2
UD4_P: U1.16 U10.3
UD_N: U1.20 U6.A7 U6.B7
UD_P: NOREF.1 U1.21
VUSB1: C8.2 U2.1 U7.1
VUSB2: C9.2 U3.1 U9.1
VUSB3: C10.2 U4.1 U8.1
VUSB4: C11.2 U5.1 U10.1
XI: C4.2 U1.11 X1.1
XO: C5.2 U1.12 X1.3
$1N2109: U6.A6 U6.B6
$1N2596: LED5.1 LED6.2 R3.2
$1N2605: LED7.1 LED8.2 R5.2
$1N2631: LED9.1 R6.2
$1N2772: R7.2 U2.5
$1N4110: R9.2 U3.5
$1N4299: R11.2 U4.5
$1N4492: R13.2 U5.5
$1N6424: LED3.1 LED4.2 R4.1 R15.2
$1N7334: LED1.1 LED2.2 R2.1 R16.2

Pads without a net: U6 1 A5 A8 B5 B8; X1 2 4

## Via types
v1: diameter 0.61, hole 0.305, Top Layer to Bottom Layer, 53 vias
v2: diameter 1.219, hole 0.61, Top Layer to Bottom Layer, 17 vias

## Routing (per net, layer and track width the routed paths; a pad name or vN(x,y) marks a point on that pad's centre or on a via; arc(x,y) is an arc through that point)
+3.3V: length 97.2
  Top Layer w0.178: U1.28 1.75,-13.79 1.68,-13.72 1.28,-13.72 0.44,-14.55 -1.79,-14.55 ; C1.2 -5.3,-13.45 -4.2,-14.55 -1.79,-14.55 ; -1.79,-14.55 C2.2
  Top Layer w0.203: -13.27,-9.48 -14.37,-8.38 v1(-15.56,-8.38) -15.56,-9.89 R10.2 ; -13.27,-9.48 -13.27,-5.59 v1(-13.53,-5.33) ; -13.27,-9.48 -13.27,-11.68 -9.97,-14.99 -6.85,-14.99 C1.2 ; LED9.2 14.33,-3.68 v1(15.68,-3.68) ; R8.2 -15.59,-16.13 -15.34,-15.88 v1(-15.3,-15.88) ; R14.2 27.59,-10.63 26.86,-9.91 25.08,-9.91 v1(24.57,-9.4) ; v1(21.78,-9.4) 19.49,-9.4 18.86,-10.03 18.86,-11.03 R12.2
  Bottom Layer w0.203: v1(24.57,-9.4) v1(21.78,-9.4) 21.4,-9.4 v1(15.68,-3.68) 14.67,-3.68 13.54,-2.56 -15.07,-2.56 v1(-15.3,-2.79) -15.3,-3.05 -13.53,-4.83 v1(-13.53,-5.33) ; v1(-15.3,-15.88) -14.92,-15.88 -14.16,-15.11 -14.16,-9.78 v1(-15.56,-8.38)
+5V: length 16.3
  Top Layer w0.191: U1.26 2.55,-13.45 1.92,-12.83 ; -0.39,-11.4 C3.2
  Top Layer w0.254: C3.2 -2.17,-9.78 -5.94,-9.78 -6.7,-10.54 -6.7,-12.57 -7.72,-13.59 F1.2 ; 1.92,-12.83 1.04,-12.83 -0.39,-11.4
GND: length 291.8
  Top Layer w0.178: R1.2 12.35,-16.37 v2(12.35,-14.99) ; 1.82,-13.26 2.15,-13.59 U1.27 ; v1(-7.18,-17.78) -6.93,-17.78 -6.75,-17.6 -6.18,-17.6 -4.62,-16.04 -3.89,-16.04 v1(-3.77,-15.93)
  Top Layer w0.191: 3.83,-27.31 4.71,-26.43 C5.1 ; 3.83,-27.31 4.08,-27.56 v1(4.09,-27.56) ; 3.83,-27.31 3.2,-27.94 C4.1
  Top Layer w0.254: -0.37,-13.21 C3.1 -0.8,-13.4 -2.75,-11.45 C2.1 ; 1.77,-13.26 -0.37,-13.26 ; v1(0.41,-18.29) 0.41,-18.42 v1(-1.37,-20.19)
  Top Layer w0.508: C1.1 C2.1 ; U2.2 -18.64,-20.45 -17.12,-21.97 C8.1 v2(-15.34,-21.97) ; v2(27.84,-15.62) C11.1 26.06,-15.62 24.54,-14.1 U5.2 ; v2(18.95,-15.62) C10.1 17.17,-15.62 15.65,-14.1 U4.2 ; U3.2 -18.64,-12.83 -17.12,-14.35 C9.1 v2(-15.34,-14.35) ; v2(21.24,-14.99) 21.49,-14.73 R13.1 ; R9.1 -21.69,-13.46 v2(-21.94,-13.72) ; R7.1 -21.69,-21.08 v2(-21.94,-21.34) ; R11.1 12.6,-14.73 v2(12.35,-14.99)
  Top Layer w1.016: C6.1 C7.1 -11.85,-10.36 v2(-11.91,-10.41)
  Top Layer w1.143: 6.45,-7.88 6.45,-9.05 7.43,-10.03 v2(8.06,-10.03)
  Bottom Layer w0.203: 11.38,-28.63 12.21,-27.8 21.45,-27.8 ; 11.38,-28.63 11.38,-26.07 9.3,-26.07 6.29,-29.08 3.11,-29.08 3.11,-28.54 v1(4.09,-27.56) ; 11.38,-28.63 11.38,-31.75 9.97,-33.16 9.97,-33.4 10.22,-33.66 10.22,-33.78 10.35,-33.91 10.35,-34.16 11.63,-35.44 11.63,-35.81 10.86,-36.58 10.86,-38.23 8.83,-40.26 -2.48,-40.26 -5.48,-37.26 -5.48,-31.45 ; -8.55,-26.42 -5.83,-26.42 -5.48,-26.07 -5.48,-31.45 ; v1(2.95,-16.13) -0.7,-16.13 -1.21,-15.62 ; -11.91,-12.51 -11.91,-16.16 ; -11.91,-12.51 v2(-11.91,-10.41) ; -11.91,-12.51 -10.78,-11.38 v1(-4.11,-11.38) -4.11,-5.73 -4.51,-5.33 -3.01,-5.33 -2.75,-5.08 -2.09,-5.08 -1.08,-4.06 4.25,-4.06 5.02,-3.3 6.67,-4.95 8.52,-4.95 8.65,-5.08 ; -11.91,-16.16 -13.78,-18.03 -16.87,-18.03 -18.31,-16.6 ; -11.91,-16.16 -10.29,-17.78 -8.4,-17.78 ; 20.32,-15.62 v2(18.95,-15.62) 14.67,-15.62 14.03,-14.99 v2(12.35,-14.99) 12.35,-12.41 9.97,-10.03 v2(8.06,-10.03) ; 20.32,-15.62 20.6,-15.62 v2(21.24,-14.99) 21.87,-15.62 v2(27.84,-15.62) ; 20.32,-15.62 20.32,-20.26 22.29,-22.23 22.29,-22.99 22.54,-23.24 22.54,-26.42 ; -1.21,-15.62 -3.47,-15.62 v1(-3.77,-15.93) ; -1.21,-15.62 0.54,-13.88 v1(0.54,-13.46) ; -5.48,-31.45 -5.78,-31.75 -18.62,-31.75 -18.62,-26.07 ; 24.52,-31.75 24.52,-26.07 24.17,-26.42 22.54,-26.42 ; 22.54,-26.42 22.54,-26.54 ; 22.54,-26.42 21.45,-26.42 21.45,-27.8 ; 21.45,-27.8 21.45,-29.04 ; -8.4,-17.78 -5.99,-20.19 v1(-1.37,-20.19) ; -8.4,-17.78 v1(-7.18,-17.78)
  Bottom Layer w0.508: -20.46,-18.76 -21.94,-20.24 v2(-21.94,-21.34) -21.94,-21.97 v2(-15.34,-21.97) -11.53,-21.97 -8.55,-24.95 -8.55,-29.04 ; -20.46,-18.76 -21.94,-17.28 v2(-21.94,-13.72) ; -20.46,-18.76 -16.06,-14.35 v2(-15.34,-14.35)
VIN: length 72
  Top Layer w0.254: F1.1 -8.67,-11.24 C7.2
  Top Layer w0.508: 23.3,-9.27 23.59,-9.56 U5.6 ; U4.6 14.7,-8 ; v2(-19.53,-8.51) -19.59,-8.51 -19.59,-9.76 ; U2.6 -19.59,-16.13 v2(-19.53,-16.13)
  Top Layer w1.016: C6.2 C7.2
  Top Layer w1.27: -0.68,-8 -4.16,-8 -6.7,-5.46 C6.2 -8.67,-4.35 -9.46,-3.56 -13.65,-3.56 -17.36,-7.27 -18.29,-7.27 v2(-19.53,-8.51) ; 23.3,-9.27 23.3,-8.74 22.56,-8 v2(11.33,-8)
  Bottom Layer w1.016: v2(-2,-8.64) 0.03,-6.6 6.38,-6.6 7.77,-8 v2(11.33,-8)
  Bottom Layer w1.27: v2(-19.53,-16.13) v2(-19.53,-8.51)
LED1: length 30
  Top Layer w0.178: v1(-4.81,-14.94) -4.81,-14.93 U1.1 ; R3.1 4.22,-30.62 v1(4.22,-28.45)
  Top Layer w0.203: 3.46,-31.13 R2.2
  Bottom Layer w0.178: v1(-4.81,-14.94) -5.05,-15.17 -5.05,-17.3 -3.87,-18.49 -0.94,-18.49 0.66,-20.1 0.66,-22.64 4.73,-26.7 4.73,-27.81 4.22,-28.32
LED2: length 26.9
  Top Layer w0.178: v1(5.23,-28.32) 5.87,-28.96 R4.2 ; v1(-4.43,-16.76) -4.29,-16.76 -4.05,-16.52 -3.51,-16.52 -2.71,-15.73 U1.3
  Top Layer w0.203: R5.1 R4.2
  Bottom Layer w0.178: v1(5.23,-28.32) 5.23,-26.67 1.04,-22.48 1.04,-19.94 -0.79,-18.11 -3.71,-18.11 -4.43,-17.38 v1(-4.43,-16.76)
LED3: length 64.3
  Top Layer w0.178: LED1.2 -0.83,-30.7 v1(0.03,-29.85) ; U1.22 4.15,-13.72 4.28,-13.59 v1(4.96,-13.59)
  Top Layer w0.203: LED4.1 7.04,-37.59 6.03,-36.58 v1(6.03,-35.69) 7.05,-35.69 R15.1 ; LED2.1 -3.5,-37.55 R16.1 -3.5,-35.11 -1.97,-33.59 -1.97,-31.97 -1.24,-31.24 LED1.2 0.03,-32.09 0.03,-34.42 0.76,-35.15 4.03,-35.15 v1(4.76,-34.42) 5.52,-34.42 5.93,-34.01 7.29,-34.01 7.9,-33.4 7.9,-31.5 8.16,-31.24 8.82,-31.24 LED3.2
  Bottom Layer w0.178: v1(4.96,-13.59) 2.69,-13.59 1.93,-12.83 -0.29,-12.83 -1.18,-13.72 -4.51,-13.72 -5.43,-14.64 -5.43,-17.46 -4.02,-18.87 -1.1,-18.87 0.28,-20.26 0.28,-22.8 2.69,-25.21 2.69,-26.92 0.03,-29.59 v1(0.03,-29.85)
  Bottom Layer w0.203: v1(6.03,-35.69) v1(4.76,-34.42)
LED4: length 124.3
  Top Layer w0.178: 29.36,-10.13 29.36,-32.07 v1(27.43,-34) ; LED7.2 9.55,-32.89 10.57,-33.91 v1(10.98,-33.91) ; v1(2.9,-12.93) 2.95,-12.98 U1.25
  Top Layer w0.203: 7.81,-34.13 8.82,-33.11 LED7.2 ; 7.81,-34.13 7.52,-34.42 6.1,-34.42 5.69,-34.82 5.5,-34.82 4.77,-35.56 0.57,-35.56 -0.83,-34.16 LED5.2 ; 7.81,-34.13 8.19,-34.51 8.19,-38.61 7.56,-39.24 LED8.1 ; R6.1 22.92,-5.84 26.48,-9.4 28.63,-9.4 29.36,-10.13 ; LED6.1 -3.02,-39.24 -2.48,-38.7 -2.48,-34.67 -1.84,-34.04 v1(-1.12,-34.04)
  Bottom Layer w0.178: 27.46,-34.04 v1(27.43,-34) 26.38,-35.05 12.13,-35.05 v1(10.98,-33.91) ; v1(-1.12,-34.04) -1.12,-30.07 2.31,-26.64 2.31,-25.37 -0.1,-22.95 -0.1,-20.41 -1.26,-19.25 -4.18,-19.25 -5.81,-17.62 -5.81,-14.48 -4.67,-13.34 -1.34,-13.34 -0.45,-12.45 2.42,-12.45 v1(2.9,-12.93)
OVCUR1#: length 30.3
  Top Layer w0.178: v1(-5.43,-19.05) -5.93,-19.54 R8.1 ; U1.24 3.35,-13.34 3.71,-12.98 v1(3.71,-12.57)
  Top Layer w0.203: R8.1 -15.73,-19.67 U2.3
  Bottom Layer w0.178: v1(-5.43,-19.05) -5.43,-18.54 -6.2,-17.78 -6.2,-14.32 -4.83,-12.95 -1.5,-12.95 -0.61,-12.07 3.2,-12.07 v1(3.71,-12.57)
OVCUR2#: length 35.8
  Top Layer w0.178: v1(-6.54,-18.29) -6.8,-18.54 -13.78,-18.54 -14.42,-17.91 -14.42,-12.45 -14.94,-11.92 R10.1 ; v1(4.5,-12.88) 4.45,-12.88 3.75,-13.58 U1.23
  Top Layer w0.203: U3.3 -15.73,-12.05 R10.1
  Bottom Layer w0.178: v1(-6.54,-18.29) -6.58,-18.25 -6.58,-14.17 -4.98,-12.57 -1.65,-12.57 -0.77,-11.68 3.71,-11.68 4.5,-12.47 v1(4.5,-12.88)
OVCUR3#: length 22.8
  Top Layer w0.178: v1(11.08,-14.86) 10.95,-14.73 9.55,-14.73 8.56,-15.73 U1.19 ; v1(16.92,-17.27) 19.08,-17.27 19.97,-16.38 19.97,-14.46 R12.1
  Top Layer w0.203: R12.1 18.56,-13.32 U4.3
  Bottom Layer w0.178: v1(11.08,-14.86) 11.08,-15.25 11.95,-16.13 15.14,-16.13 16.28,-17.27 16.79,-17.27
OVCUR4#: length 32.5
  Top Layer w0.178: R14.1 28.98,-14.59 28.98,-16.26 26.69,-18.56 22.01,-18.56 21.36,-17.91 v1(17.81,-17.91) ; v1(10.44,-15.37) 10.19,-15.11 9.81,-15.11 8.79,-16.13 U1.18
  Top Layer w0.203: U5.3 27.45,-13.32 R14.1
  Bottom Layer w0.178: v1(10.44,-15.37) 10.7,-15.62 10.91,-15.62 11.8,-16.51 14.98,-16.51 16.38,-17.91 17.68,-17.91
PWREN1#: length 20.8
  Top Layer w0.178: U2.4 -17.69,-17.76 -16.91,-18.54 -14.58,-18.54 -14.07,-19.05 -6.32,-19.05 -5.69,-18.42 -5.23,-18.42 -3.72,-16.9 -3.32,-16.9 -2.54,-16.13 U1.4
PWREN2#: length 27.3
  Top Layer w0.178: U1.2 -4.09,-15.33 -4.42,-15.66 -4.78,-15.66 -6.27,-17.15 -7.57,-17.15 -8.59,-18.16 -13.53,-18.16 -13.91,-17.78 -13.91,-11.68 -14.67,-10.92 -17.21,-10.92 -17.69,-10.44 -17.69,-9.76
PWREN3#: length 24.4
  Top Layer w0.191: v1(2.19,-21.46) 2.55,-21.1 2.55,-18.13
  Top Layer w0.203: v1(8.44,-14.73) 8.44,-14.61 10.86,-12.19 13.65,-12.19 13.85,-12.4 15.51,-12.4 15.72,-12.19 16.19,-12.19 16.6,-11.79 U4.4
  Bottom Layer w0.178: v1(8.44,-14.73) 8.06,-14.73 4.88,-17.91 3.2,-17.91 2.69,-18.42 2.69,-20.96 v1(2.19,-21.46)
PWREN4#: length 40.5
  Top Layer w0.178: U1.5 -2.4,-16.53 -3.38,-17.5 v1(-3.47,-17.5)
  Top Layer w0.203: U5.4 25.49,-11.53 24.83,-12.19 24.61,-12.19 24.45,-12.35 22.69,-12.35 22.54,-12.19 17.59,-12.19 17.33,-11.94 v1(17.33,-9.78) ; v1(13.52,-9.78) 12.09,-9.78 11.24,-10.64 11.24,-10.92 v1(8.44,-13.72)
  Bottom Layer w0.178: v1(8.44,-13.72) 4.63,-17.53 -0.61,-17.53 -0.81,-17.73 -3.24,-17.73 v1(-3.47,-17.5)
  Bottom Layer w0.203: v1(17.33,-9.78) v1(13.52,-9.78)
RST: length 5.2
  Top Layer w0.178: R1.1 10.08,-16.53 U1.17
UD1_N: length 19.3
  Top Layer w0.191: 0.95,-16.93 -0.89,-16.93 -1.53,-17.57 -1.8,-17.57
  Top Layer w1: -13.05,-26.42 -13.05,-25.11 -12.63,-24.68 -12.63,-23.71 -10.76,-21.84 -6.07,-21.84 -1.8,-17.57
UD1_P: length 19
  Top Layer w0.191: U1.7 -0.2,-17.33 -0.99,-18.12 -0.99,-18.39
  Top Layer w1: -11.05,-26.42 -11.05,-25.11 -11.47,-24.68 -11.47,-24.18 -10.28,-22.99 -9.67,-22.99 -8.67,-23.99 -8.01,-23.99 -7.01,-22.99 -5.59,-22.99 -4.56,-21.96 -3.89,-21.96 -2.89,-20.96 -2.89,-20.29 -0.99,-18.39
UD2_N: length 22.7
  Top Layer w0.191: 1.17,-19.3 1.75,-18.72 U1.8
  Top Layer w0.635: -13.05,-29.04 -11.76,-27.74 -7.89,-27.74 -6.99,-28.65 ; -4.82,-28.47 -5,-28.65 -6.99,-28.65 ; -6.99,-28.65 -7.03,-28.65
  Top Layer w1: 1.04,-19.3 -2.89,-23.24 -2.89,-27.44 -3.89,-28.44 -4.79,-28.44
UD2_P: length 22.7
  Top Layer w0.191: 1.56,-20.41 2.15,-19.82 2.15,-18.13
  Top Layer w0.635: -11.05,-29.04 -9.76,-30.34 -7.89,-30.34 -6.99,-29.43 -4.96,-29.43 -4.67,-29.72
  Top Layer w1: 1.68,-20.32 -1.74,-23.75 -1.74,-27.96 -3.38,-29.6 -4.8,-29.6
UD3_N: length 19.7
  Top Layer w0.191: 4.16,-19.96 3.75,-19.54 3.75,-18.13 U1.13 ; 4.17,-19.96 4.17,-19.99
  Top Layer w1: 4.17,-19.99 8.37,-24.2 8.87,-24.2 9.23,-23.83 17.02,-23.83 17.37,-24.18 17.37,-24.68 16.95,-25.11 16.95,-26.42
UD3_P: length 19.9
  Top Layer w0.191: 4.98,-19.18 4.71,-19.18 4.15,-18.61 U1.14
  Top Layer w1: 4.98,-19.18 8.48,-22.68 17.5,-22.68 18.52,-23.71 18.52,-24.68 18.95,-25.11 18.95,-26.42
UD4_N: length 40.5
  Top Layer w0.191: 6.83,-18.22 6.83,-17.95 6.22,-17.34 4.96,-17.34 U1.15
  Top Layer w0.635: 16.95,-29.04 18.24,-27.74 22.11,-27.74 23.01,-28.65 25.61,-28.65 25.91,-28.35
  Top Layer w1.001: 6.83,-18.22 9.45,-20.83 18.47,-20.83 20.92,-23.28 22.34,-23.28 23.64,-21.98 24.29,-21.98 27.02,-24.71 27.02,-27.24 25.91,-28.35
UD4_P: length 40.7
  Top Layer w0.191: 7.65,-17.4 7.24,-17.4 6.77,-16.93 5.61,-16.93 5.61,-16.93 U1.16
  Top Layer w0.635: 18.95,-29.04 20.24,-30.34 22.77,-30.34 23.55,-29.56 25.9,-29.56 26,-29.66
  Top Layer w1.001: 7.65,-17.4 9.92,-19.68 23.62,-19.68 28.17,-24.23 28.17,-27.71 26.23,-29.66 26,-29.66
UD_N: length 12.9
  Top Layer w0.188: 7.28,-14.91 6.93,-15.33 4.95,-15.33 U1.20
  Top Layer w1.001: 1.95,-7.88 1.95,-8.98 2.94,-9.98 4.92,-9.98 7.28,-12.33 7.28,-14.91
UD_P: length 13.1
  Top Layer w0.188: 6.12,-14.72 5.91,-14.93 U1.21
  Top Layer w1.001: v2(1.42,-10.54) 1.17,-10.8 1.17,-11.59 1.49,-11.91 2.9,-11.91 3.43,-11.38 4.7,-11.38 6.12,-12.81 6.12,-14.35
  Bottom Layer w1.001: v2(1.42,-10.54) 3.2,-8.76 NOREF.1
VUSB1: length 9.7
  Top Layer w0.508: C8.2 -20.17,-21.9 -20.17,-20.7 -19.59,-20.13 U2.1
  Top Layer w0.762: C8.2 -18.33,-23.88 -16.99,-23.88 -15.55,-25.32 -15.55,-26.42
VUSB2: length 25.2
  Top Layer w0.508: U3.1 -19.59,-12.51 -20.17,-13.08 -20.17,-14.28 C9.2
  Top Layer w0.762: -15.55,-29.04 -20.08,-29.04 -23.47,-25.65 -23.47,-16.51 -22.48,-15.52 -21.28,-15.52 -20.23,-14.47 C9.2
VUSB3: length 13.5
  Top Layer w0.508: U4.1 14.7,-13.78 14.12,-14.35 14.12,-15.55 C10.2
  Top Layer w0.762: v2(14.45,-17.91) 14.06,-17.52 C10.2
  Bottom Layer w0.762: v2(14.45,-17.91) 14.45,-26.42
VUSB4: length 39.4
  Top Layer w0.508: C11.2 23.01,-15.55 23.01,-14.35 23.59,-13.78 U5.1
  Top Layer w0.762: C11.2 22.95,-17.59 v2(23.01,-17.65)
  Bottom Layer w0.762: 14.45,-29.04 19.7,-34.29 25.55,-34.29 29.62,-30.23 29.62,-23.5 23.78,-17.65 v2(23.01,-17.65)
XI: length 11.1
  Top Layer w0.191: C4.2 0.32,-27.84 X1.1 0.68,-25.77 1.42,-25.02 1.42,-23.37 2.95,-21.85 U1.11
XO: length 8.5
  Top Layer w0.191: U1.12 3.35,-22.46 2.44,-23.37 2.44,-23.93 X1.3 4.6,-24.02 C5.2
$1N2596: length 16.3
  Top Layer w0.203: LED6.2 -0.86,-39.24 -0.32,-38.7 -0.32,-36.58 v1(0.19,-36.07) ; v1(3.46,-34.42) 3.46,-33.13 ; LED5.1 -3.79,-33.66 v1(-4.26,-33.66)
  Bottom Layer w0.203: v1(-4.26,-33.66) -3.49,-33.66 -1.08,-36.07 v1(0.19,-36.07) 0.92,-36.07 2.57,-34.42 v1(3.46,-34.42)
$1N2605: length 24.4
  Top Layer w0.203: v1(10.73,-35.43) 10.31,-35.85 10.31,-38.99 9.93,-39.37 9.46,-39.37 LED8.2 ; v1(10.06,-28.19) 10.04,-28.19 R5.2 ; 6.03,-32.89 5.62,-32.89 4.98,-32.26 4.98,-30.61 v1(5.36,-30.23) ; 6.03,-32.89 6.62,-32.89 LED7.1 6.04,-32.89 6.03,-32.89 ; 6.03,-32.89 v1(5.27,-33.66)
  Bottom Layer w0.203: v1(10.73,-35.43) 9.72,-35.43 8.17,-33.88 5.5,-33.88 v1(5.27,-33.66) ; v1(5.36,-30.23) 8.03,-30.23 v1(10.06,-28.19)
$1N2631: length 2.4
  Top Layer w0.203: LED9.1 11.99,-5.69 R6.2
$1N2772: length 4.2
  Top Layer w0.203: U2.5 -18.64,-18.03 -19.02,-18.42 -20.82,-18.42 R7.2
$1N4110: length 4.2
  Top Layer w0.203: -18.64,-9.76 -18.64,-10.41 -19.02,-10.8 -20.82,-10.8 R9.2
$1N4299: length 4.1
  Top Layer w0.203: R11.2 13.36,-11.19 14.11,-11.94 15.39,-11.94 15.65,-11.68 U4.5
$1N4492: length 4.1
  Top Layer w0.203: U5.5 24.54,-11.68 24.28,-11.94 23,-11.94 22.25,-11.19 R13.2
$1N6424: length 13
  Top Layer w0.203: v1(5.62,-31.24) 5.62,-31.24 LED3.1 8.65,-29.21 R4.1 ; v1(9.68,-34.29) 9.17,-34.8 R15.2 9.33,-35.72 LED4.2
  Bottom Layer w0.203: v1(5.62,-31.24) 6.63,-31.24 v1(9.68,-34.29)
$1N7334: length 16.3
  Top Layer w0.203: LED2.2 -1.34,-35.72 R16.2 -0.57,-35.56 v1(-0.45,-35.43) ; LED1.1 -3.03,-31.16 v1(-1.84,-29.97) ; v1(1.55,-34.42) R2.1
  Bottom Layer w0.203: -1.5,-35.05 -1.12,-35.43 v1(-0.45,-35.43) ; -1.5,-35.05 -1.12,-34.67 1.3,-34.67 v1(1.55,-34.42) ; -1.5,-35.05 -1.92,-34.63 -1.92,-33.6 -1.51,-33.2 -1.51,-30.31 v1(-1.84,-29.97)

## Copper pours and planes (outline as drawn; the poured copper is in the pictures)
UD1_N on Top Layer: -1.93,-16.84 -0.84,-16.84 -0.84,-17.83 -1.93,-17.83
UD1_P on Top Layer: -1.24,-17.25 -0.15,-17.25 -0.15,-18.57 -1.24,-18.57
UD2_P on Top Layer: 1.45,-19.18 2.24,-19.18 2.24,-20.47 1.45,-20.47

Small or netless copper shapes (teardrops, artwork), in the pictures only: 7 on Top Layer
